# Altium schematic sheet Mechanics.SchDoc
size A4
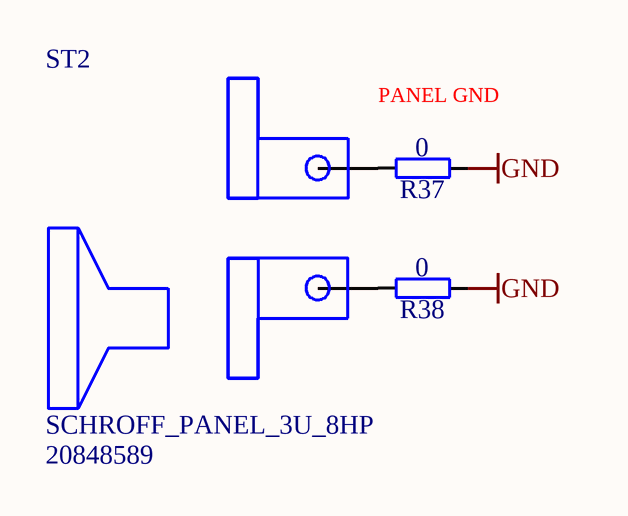
[diagram p0: Mechanics.SchDoc]

## Parts
R37  0  [RESC1608X55N]
R38  0  [RESC1608X55N]
ST2  SCHROFF_PANEL_3U_8HP  Manufacturer Part Number 2: 20848589  [SCHROFF_PANEL_3HP_8U_CPCIS_AC_PSU]

## Nets
GND: R37.1 R38.1
NetR37_2: R37.2 ST2.1
NetR38_2: R38.2 ST2.0

## Notes on the sheet
- PANEL GND

## Library data of the parts
R37 R38 = R0603_0R_JUMPER: Resistor; Part Description: 1A (0.05R Max DC Resistance) Zero Ohm Jumper; Manufacturer: GENERIC; Manufacturer1 Part Number: NRC06Z0; PressFit: No; Part Number: R0603_0R_JUMPER; Component Kind: Standard; Component Type: Standard; Pin Count: 2; Value: 0; Status: Preferred; Manufacturer Part Number: R0603_0R_JUMPER; Case: 0603; Mounted: Yes; Sense: No; Socket: No; SMD: Yes; Manufacturer1 Example: NIC COMPONENT; Manufacturer1 ComponentHeight: 0.55mm; HelpURL: \\cern.ch\dfs\Applications\Altium\Datasheets\R0603_NIC_NRC.pdf; Author: CERN DEM JLC; CreateDate: 03.12.2007; LatestRevisionDate: 13.03.2008
ST2 = SCHROFF_PANEL_3U_8HP_CPCIS_PSU: Schroff 8HP 4U EUROCARD Panel with ejector; Manufacturer: Schroff; Manufacturer Part Number: 20848589